# EAGLE design feather_stm32f1 (EAGLE 9.2.2)
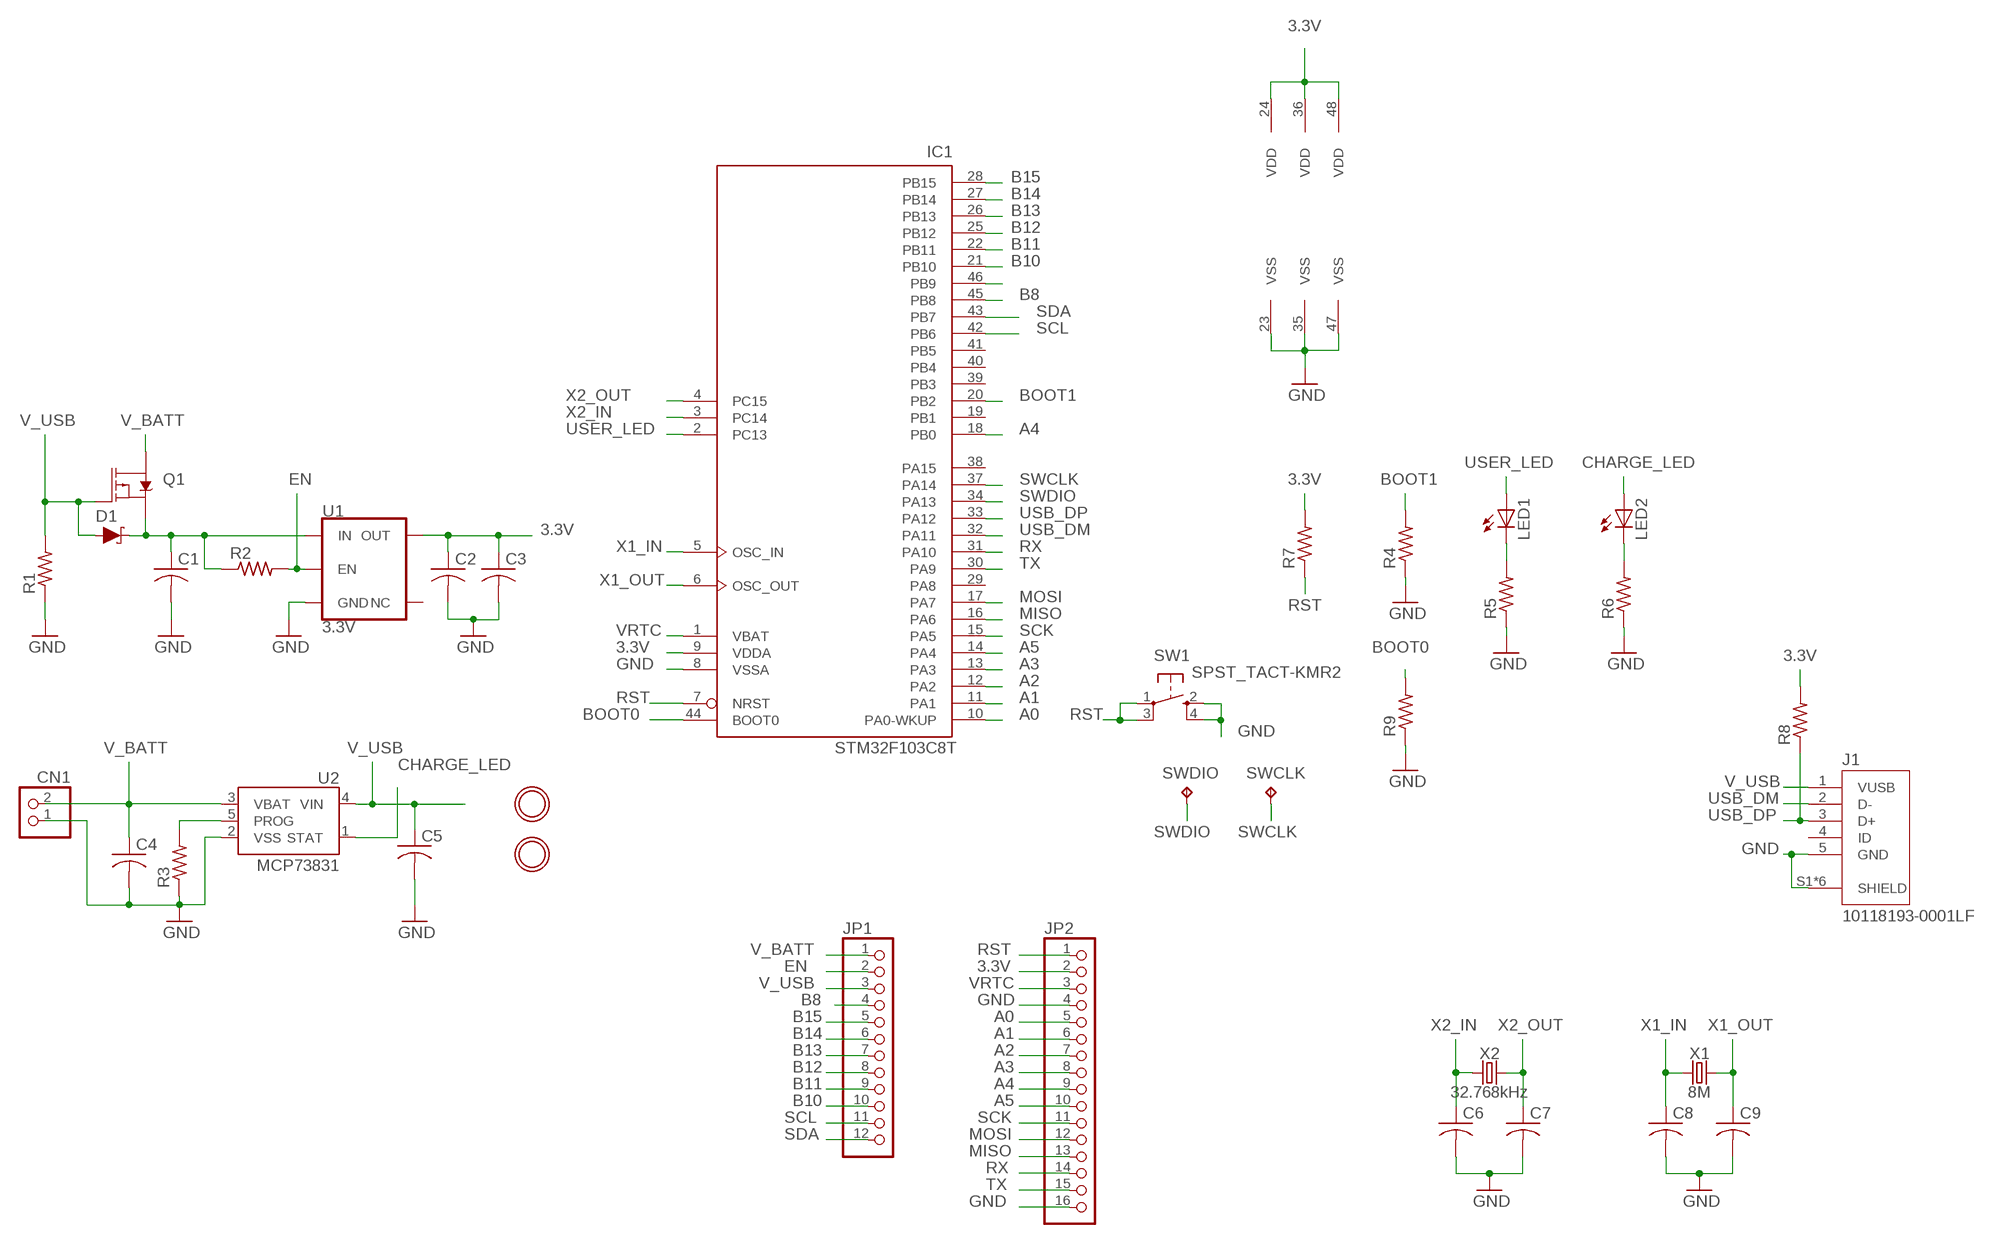
[diagram p0: schematic, sheet 1]

## Parts
C1  C-USC0805  [C0805]
C2  C-USC0805  [C0805]
C3  C-USC0805  [C0805]
C4  C-USC0805  [C0805]
C5  C-USC0805  [C0805]
C6  C-USC0603  [C0603]
C7  C-USC0603  [C0603]
C8  C-USC0603  [C0603]
C9  C-USC0603  [C0603]
CN1  JST_2PIN-SMT-RA  [JST-PH-2-SMT-RA]
D1  DIODE-SCHOTTKY-BAT20J  [SOD-323]
IC1  STM32F103C8T  [LQFP48]
J1  10118193-0001LF  [FCI_10118193-0001LF]
JP1  PINHD-1X12-CB  [1X12-CB]
JP2  PINHD16  [1X16-CB]
LED1  LEDCHIPLED_0603  [CHIPLED_0603]
LED2  LEDCHIPLED_0603  [CHIPLED_0603]
Q1  MOSFET_PCH-DMG2307L  [SOT23-3]
R1  R-US_R0603  [R0603]
R2  R-US_R0603  [R0603]
R3  R-US_R0603  [R0603]
R4  R-US_R0603  [R0603]
R5  R-US_R0603  [R0603]
R6  R-US_R0603  [R0603]
R7  R-US_R0603  [R0603]
R8  R-US_R0603  [R0603]
R9  R-US_R0603  [R0603]
SW1  SPST_TACT-KMR2  [KMR2]
SWCLK  TPTP20R  [TP20R]
SWDIO  TPTP20R  [TP20R]
U1  3.3V  V_REG_AP2112K-3.3V  [SOT23-5]
U2  MCP73831  [SOT23-5]
U$1  MOUNTINGHOLE2.5  [MOUNTINGHOLE_2.5_PLATED]
U$31  MOUNTINGHOLE2.5  [MOUNTINGHOLE_2.5_PLATED]
X1  8M  CRYSTALSMD-5X3.2-2PAD  [CRYSTAL-SMD-5X3.2-2PAD]
X2  32.768kHz  CRYSTAL-32.768KHZSMD-3.2X1.5  [CRYSTAL-SMD-3.2X1.5MM]

## Nets
3.3V: C2.1 C3.1 IC1.9(VDDA) IC1.24(VDD) IC1.36(VDD) IC1.48(VDD) JP2.2 R7.2 R8.2 U1.5(OUT)
A0: IC1.10(PA0-WKUP) JP2.5
A1: IC1.11(PA1) JP2.6
A2: IC1.12(PA2) JP2.7
A3: IC1.13(PA3) JP2.8
A4: IC1.18(PB0) JP2.9
A5: IC1.14(PA4) JP2.10
B8: IC1.45(PB8) JP1.4
B10: IC1.21(PB10) JP1.10
B11: IC1.22(PB11) JP1.9
B12: IC1.25(PB12) JP1.8
B13: IC1.26(PB13) JP1.7
B14: IC1.27(PB14) JP1.6
B15: IC1.28(PB15) JP1.5
BOOT0: IC1.44(BOOT0) R9.2
BOOT1: IC1.20(PB2) R4.2
CHARGE_LED: LED2.A U2.1(STAT)
EN: JP1.2 R2.2 U1.3(EN)
GND: C1.2 C2.2 C3.2 C4.2 C5.2 C6.2 C7.2 C8.2 C9.2 CN1.1 IC1.8(VSSA) IC1.23(VSS) IC1.35(VSS) IC1.47(VSS) J1.5(GND) J1.S1(SHIELD) J1.S2(SHIELD) J1.S3(SHIELD) J1.S4(SHIELD) J1.S5(SHIELD) J1.S6(SHIELD) JP2.4 JP2.16 R1.1 R3.1 R4.1 R5.1 R6.1 R9.1 SW1.2(S) SW1.4(S1) U1.2(GND) U2.2(VSS)
MISO: IC1.16(PA6) JP2.13
MOSI: IC1.17(PA7) JP2.12
N$1: C1.1 D1.C Q1.2(S) R2.1 U1.1(IN)
N$2: R3.2 U2.5(PROG)
N$4: LED1.C R5.2
N$5: LED2.C R6.2
N$30: IC1.46(PB9)
RST: IC1.7(NRST) JP2.1 R7.1 SW1.1(P) SW1.3(P1)
RX: IC1.31(PA10) JP2.14
SCK: IC1.15(PA5) JP2.11
SCL: IC1.42(PB6) JP1.11
SDA: IC1.43(PB7) JP1.12
SWCLK: IC1.37(PA14) SWCLK.TP
SWDIO: IC1.34(PA13) SWDIO.TP
TX: IC1.30(PA9) JP2.15
USB_DM: IC1.32(PA11) J1.2(D-)
USB_DP: IC1.33(PA12) J1.3(D+) R8.1
USER_LED: IC1.2(PC13) LED1.A
V_BATT: C4.1 CN1.2 JP1.1 Q1.3(D) U2.3(VBAT)
V_USB: C5.1 D1.A J1.1(VUSB) JP1.3 Q1.1(G) R1.2 U2.4(VIN)
VRTC: IC1.1(VBAT) JP2.3
X1_IN: C8.1 IC1.5(OSC_IN) X1.P$1
X1_OUT: C9.1 IC1.6(OSC_OUT) X1.P$2
X2_IN: C6.1 IC1.3(PC14) X2.P$1
X2_OUT: C7.1 IC1.4(PC15) X2.P$2
Unconnected: IC1.19(PB1) IC1.29(PA8) IC1.38(PA15) IC1.39(PB3) IC1.40(PB4) IC1.41(PB5) J1.4(ID) U1.4(NC)

## Library data of the parts
C1-C9 = rcl:C-US: CAPACITOR, American symbol; SPICEPREFIX: C
CN1 = adafruit:JST_2PIN: JST 2-Pin Connectors of various flavors SMT-RA (S2B-PH-SM4) 4UConnector #17311 SMT (B2B-PH-SM4) THM-RA (S2B-PH) THM (B2B-PH)
D1 = SparkFun-DiscreteSemi:DIODE-SCHOTTKY: Schottky diode A Schottky diode is a semiconductor diode which has a low forward voltage drop and a very fast switching action.; PROD_ID: DIO-11623; VALUE: 1A/23V/620mV
IC1 = micro-stm:STM32F103C*T: ARM 32-bit Cortex™-M3 CPU 72 MHz maximum frequency 16 to 128 Kbytes of Flash memory 6 to 20 kbytes of SRAM 37 GPIOs 2.0 to 3.6 V application supply
J1 = 10118193-0001LF:10118193-0001LF: Micro USB B Type Receptacle; DESCRIPTION: Single Port 5 Contact Shielded SMT MICRO USB B-Type Receptacle; DIGI-KEY_PART_NUMBER: 609-4616-1-ND; DIGI-KEY_PURCHASE_URL: https://www.digikey.tw/product-detail/en/amphenol-icc-fci/10118193-0001LF/609-4616-1-ND/2785380?utm_source=snapeda&utm_medium=aggregator&utm_campaign=symbol; MF: Amphenol ICC; MP: 10118193-0001LF; PACKAGE: None
JP1 = adafruit:PINHD-1X12: PIN HEADER
JP2 = explora26:PINHD16
LED1 LED2 = adafruit:LED: LED OSRAM: - CHIPLED LG R971, LG N971, LY N971, LG Q971, LY Q971, LO R971, LY R971 LH N974, LH R974 LS Q976, LO Q976, LY Q976 LO Q996 - Hyper CHIPLED LW Q18S LB Q993, LB Q99A, LB R99A - SideLED LS A670, LO A670, LY A670, LG A670, LP A670 LB A673, LV A673, LT A673, LW A673 LH A674 LY A675 LS A676, LA A676, LO A676, LY A676, LW A676 LS A679, LY A679, LG A679 - Hyper Micro SIDELED® LS Y876, LA Y876, LO Y876, LY Y876 LT Y87S - SmartLED LW L88C, LW L88S LB L89C, LB L89S, LG L890 LS L89K, LO L89K, LY L89K LS L896, LA L896, LO L896, LY L896 - TOPLED LS T670, LO T670, LY T670, LG T670, LP T670 LSG T670, LSP T670, LSY T670, LOP T670, LYG T670 LG T671, LOG T671, LSG T671 LB T673, LV T673, LT T673, LW T673 LH T674 LS T676, LA T676, LO T676, LY T676, LB T676, LH T676, LSB T676, LW T676 LB T67C, LV T67C, LT T67C, LS T67K, LO T67K, LY T67K, LW E67C LS E67B, LA E67B, LO E67B, LY E67B, LB E67C, LV E67C, LT E67C LW T67C LS T679, LY T679, LG T679 LS T770, LO T770, LY T770, LG T770, LP T770 LB T773, LV T773, LT T773, LW T773 LH T774 LS E675, LA E675, LY E675, LS T675 LS T776, LA T776, LO T776, LY T776, LB T776 LHGB T686 LT T68C, LB T68C - Hyper Mini TOPLED® LB M676 - Mini TOPLED Santana® LG M470 LS M47K, LO M47K, LY M47K Source: http://www.osram.convergy.de/
Q1 = SparkFun-DiscreteSemi:MOSFET_PCH: P-channel MOSFETs Voltage controlled devices that allow control of high current outputs. SparkFun Products: SparkFun ESP32 Thing <https://www.sparkfun.com/products/13907> SparkFun ESP8266 Thing <https://www.sparkfun.com/products/13231>; PROD_ID: TRANS-11308; VALUE: 2.5A/30V/105mΩ
R1-R9 = rcl:R-US_: RESISTOR, American symbol; SPICEPREFIX: R
SW1 = adafruit:SPST_TACT: SMT 6mm switch, EVQQ2 series http://www.ladyada.net/library/eagle
SWCLK SWDIO = testpad:TP: Test pad
U1 = SparkFun-IC-Power:V_REG_AP2112: AP2112 - 600mA CMOS LDO Regulator w/ Enable The AP2112 is CMOS process low dropout linear regulator with enable function, the regulator delivers a guaranteed 600mA (min.) continuous load current. Features Output Voltage Accuracy: ±1.5% Output Current: 600mA (Min.) Foldback Short Current Protection: 50mA Enable Function to Turn ON/OFF VOUT Low Dropout Voltage (3.3V): 250mV (Typ.) @IOUT=600mA Excellent Load Regulation: 0.2%/A (Typ.) Excellent Line Regulation: 0.02%/V (Typ.) Low Quiescent Current: 55μA (Typ.) Low Standby Current: 0.01μA (Typ.) Low Output Noise: 50μVRMS PSRR: 100Hz -65dB, 1kHz -65dB OTSD Protection Stable with 1.0μF Flexible Cap: Ceramic, Tantalum and Aluminum Electrolytic Operation Temperature Range: -40°C to 85°C ESD: MM 400V, HBM 4000V; PROD_ID: VREG-12457
U2 = SparkFun-IC-Power:MCP73831: MCP73831T Li-Ion, Li-Pol Controller Miniature single cell, fully integrated Li-Ion, Li-polymer charge management controller Datasheet <http://ww1.microchip.com/downloads/en/DeviceDoc/20001984g.pdf> SparkFun Products: SparkFun ESP32 Thing <https://www.sparkfun.com/products/13907> SparkFun 9DoF Razor IMU M0 <https://www.sparkfun.com/products/14001>; PROD_ID: IC-09995
U$1 U$31 = microbuilder:MOUNTINGHOLE: Mounting Hole For #2 screws (0.086"/2.18mm width, 0.094"/2.4mm hole) use 2.5mm; BOM: EXCLUDE
X1 = SparkFun-Clocks:CRYSTAL: Crystals (Generic) These are passive quartz crystals, which can be used as a clock source for a microcontroller. Crystal's are two-terminal devices. They require external "load" capacitors to generate an oscillating signal.
X2 = SparkFun-Clocks:CRYSTAL-32.768KHZ: 32.768kHz Crystal Frequency: 32.768kHz Frequency Stability: ±20ppm Load Capacitance: 12.5pF (PTH-2X6 & SMD-3.2X1.5), 6pF (SMD-2X6) SparkFun Products: SparkFun BigTime Watch Kit <https://www.sparkfun.com/products/11734> SparkFun nRF52832 Breakout <https://www.sparkfun.com/products/13990> SparkFun Real Time Clock Module <https://www.sparkfun.com/products/12708>; PROD_ID: XTAL-13062

## Board
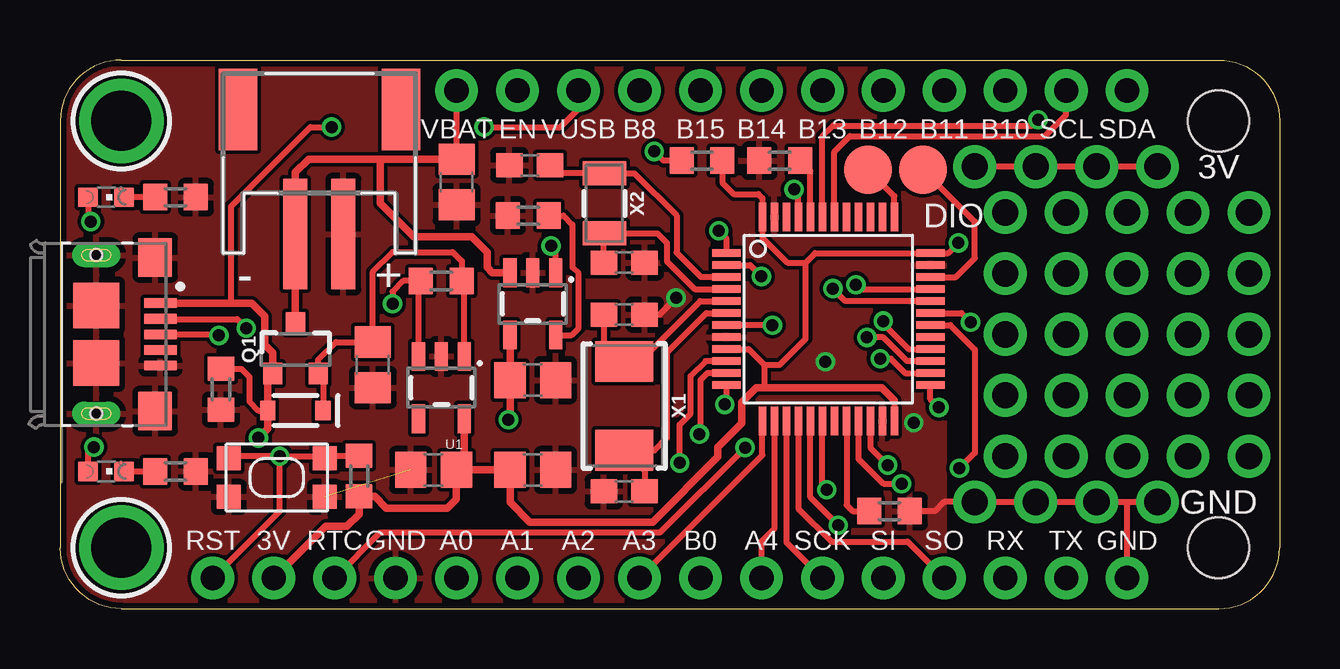
[diagram p1: board, top side]
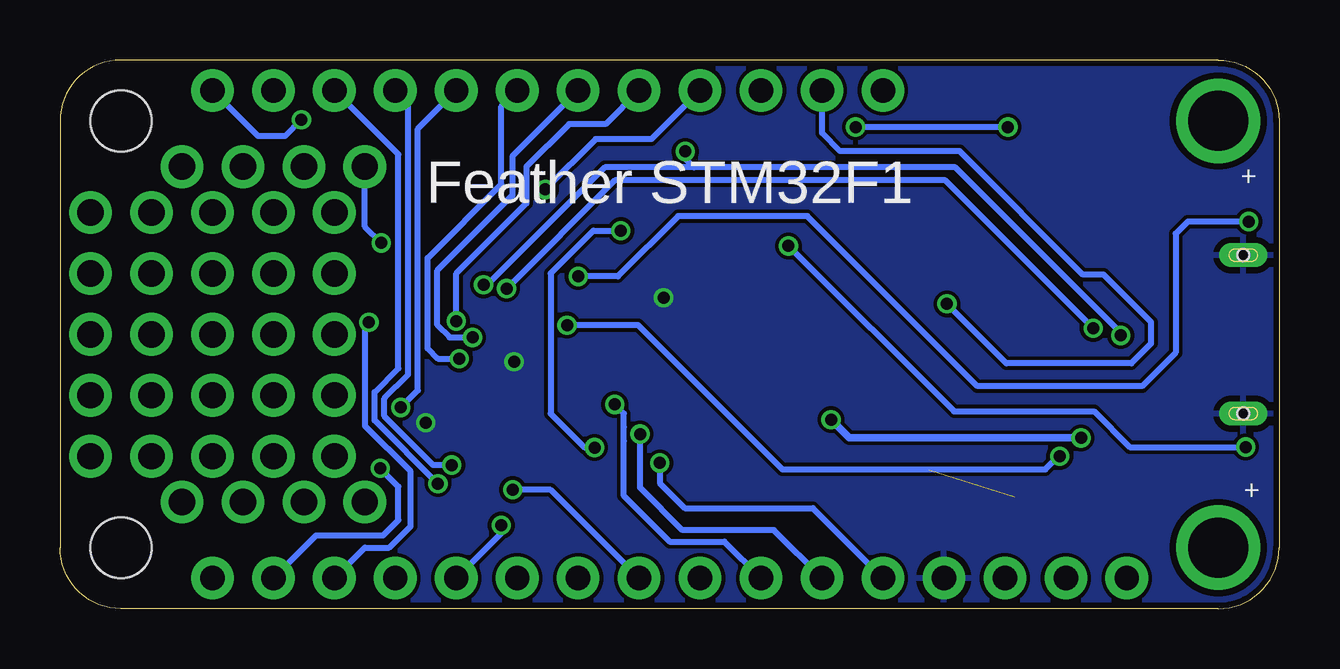
[diagram p2: board, bottom side, seen from below]

Size 50.8 x 22.86 mm. Coordinates in mm from the lower left corner, seen from the top.
Outline: 2.54,0 48.26,0 arc90 50.8,2.54 50.8,20.32 arc90 48.26,22.86 2.54,22.86 arc90 0,20.32 0,2.54 arc90 2.54,0
Copper layers (1*16): Top 0.035mm / dielectric 1.5mm / Bottom 0.035mm
Design rules "SeeedStudio_2layer_DRU_no_angle_20140221 *": minimum track width 6mil, minimum drill 12mil, track to track 6mil, track to pad 6mil, pad to pad 6mil, via to via 6mil, smd to smd 0mil, copper to edge 10mil, drill to drill 12mil, minimum pad ring 10mil, minimum via ring 6mil, stop-mask expansion 2mil, vias tented up to drill 100mil, thermal gap 10mil
Holes 2.54 mm at 48.26,20.32 48.26,2.54

### Footprints (pad centres in the part's own frame; a part is rotated, then mirrored left to right if it is on the bottom)
C0805 = smd 1.3 x 1.5: 1 -0.95,0; 2 0.95,0
C0603 = smd 1.1 x 1: 1 -0.85,0; 2 0.85,0
JST-PH-2-SMT-RA = smd 1 x 4.6: 1 1,-3.7; 2 -1,-3.7 | smd 1.6 x 3.4: NC1 -3.4,1.5; NC2 3.4,1.5
SOD-323 = smd 0.63 x 0.83: A 1.15,0; C -1.15,0
LQFP48 = smd 0.3 x 1.2: 1 -2.75,-4.25; 2 -2.25,-4.25; 3 -1.75,-4.25; 4 -1.25,-4.25; 5 -0.75,-4.25; 6 -0.25,-4.25; 7 0.25,-4.25; 8 0.75,-4.25; 9 1.25,-4.25; 10 1.75,-4.25; 11 2.25,-4.25; 12 2.75,-4.25; 25 2.75,4.25; 26 2.25,4.25; 27 1.75,4.25; 28 1.25,4.25; 29 0.75,4.25; 30 0.25,4.25; 31 -0.25,4.25; 32 -0.75,4.25; 33 -1.25,4.25; 34 -1.75,4.25; 35 -2.25,4.25; 36 -2.75,4.25 | smd 1.2 x 0.3: 13 4.25,-2.75; 14 4.25,-2.25; 15 4.25,-1.75; 16 4.25,-1.25; 17 4.25,-0.75; 18 4.25,-0.25; 19 4.25,0.25; 20 4.25,0.75; 21 4.25,1.25; 22 4.25,1.75; 23 4.25,2.25; 24 4.25,2.75; 37 -4.25,2.75; 38 -4.25,2.25; 39 -4.25,1.75; 40 -4.25,1.25; 41 -4.25,0.75; 42 -4.25,0.25; 43 -4.25,-0.25; 44 -4.25,-0.75; 45 -4.25,-1.25; 46 -4.25,-1.75; 47 -4.25,-2.25; 48 -4.25,-2.75
FCI_10118193-0001LF = smd 0.4 x 1.35: 1 -1.3,2.675; 2 -0.65,2.675; 3 0,2.675; 4 0.65,2.675; 5 1.3,2.675 | smd 1.6 x 1.4: S1 -3.2,2.45; S2 3.2,2.45 | smd 1.9 x 1.9: S3 1.2,0; S4 -1.2,0 | drill 0.5 pad 0.9 long: S5 -3.3,0; S6 3.3,0 | hole 0.5: -3.3,0; 3.3,0
1X12-CB = drill 1.016 pad 1.778: 1 -13.97,0; 2 -11.43,0; 3 -8.89,0; 4 -6.35,0; 5 -3.81,0; 6 -1.27,0; 7 1.27,0; 8 3.81,0; 9 6.35,0; 10 8.89,0; 11 11.43,0; 12 13.97,0
1X16-CB = drill 1.016 pad 1.778: 1 -19.05,0; 2 -16.51,0; 3 -13.97,0; 4 -11.43,0; 5 -8.89,0; 6 -6.35,0; 7 -3.81,0; 8 -1.27,0; 9 1.27,0; 10 3.81,0; 11 6.35,0; 12 8.89,0; 13 11.43,0; 14 13.97,0; 15 16.51,0; 16 19.05,0
CHIPLED_0603 = smd 0.8 x 0.8: A 0,-0.75; C 0,0.75
SOT23-3 = smd 0.8 x 0.9: 1 -0.95,-1; 2 0.95,-1; 3 0,1.1
R0603 = smd 1 x 1.1: 1 -0.85,0; 2 0.85,0
KMR2 = smd 1 x 1: 1 2,0.8; 2 2,-0.8; 3 -2,0.8; 4 -2,-0.8
TP20R = smd 2 x 2: TP 0,0
SOT23-5 = smd 0.55 x 1.2: 1 -0.95,-1.3; 2 0,-1.3; 3 0.95,-1.3; 4 0.95,1.3; 5 -0.95,1.3
MOUNTINGHOLE_2.5_PLATED = drill 2.5 pad 3.2: P$1 0,0
CRYSTAL-SMD-5X3.2-2PAD = smd 1.7 x 2.4: P$1 1.85,0; P$2 -1.85,0
CRYSTAL-SMD-3.2X1.5MM = smd 1 x 1.8: P$1 -1.25,0; P$2 1.25,0

### Placement (x,y rotation side)
C1  13.02,10.16 270 top
C2  15.55,5.78 180 top
C3  19.68,5.78 0 top
C4  16.51,17.78 270 top
C5  19.68,9.53 0 top
C6  19.56,18.48 180 top
C7  23.5,14.41 0 top
C8  23.5,12.26 0 top
C9  23.5,4.89 180 top
CN1  10.79,19.3 0 top
D1  9.79,8.26 180 top
IC1  32,12.06 270 top
J1  1.5,11.43 270 top
JP1  30.48,21.59 0 top
JP2  25.4,1.27 0 top
LED1  1.91,17.14 270 top
LED2  1.91,5.71 270 top
Q1  9.79,10.79 0 top
R1  6.69,9.14 90 top
R2  15.88,13.65 180 top
R3  19.49,16.37 0 top
R4  34.54,4.06 180 top
R5  4.8,17.14 180 top
R6  4.8,5.71 180 top
R7  12.45,5.52 270 top
R8  26.73,18.67 0 top
R9  29.97,18.67 0 top
SW1  9.02,5.46 0 top
SWCLK  33.66,18.29 0 top
SWDIO  35.94,18.29 0 top
U1  15.88,9.21 180 top
U2  19.68,12.7 180 top
U$1  2.54,20.32 0 top
U$31  2.54,2.54 0 top
X1  23.5,8.45 90 top
X2  22.67,16.89 270 top

### Tracks (layer width: path | path; a pad name or v marks a point on that pad's centre or on a via)
3.3V  (via drill 0.5, 1.1 pad 1.78)
  Top 0.254: v45.72,18.41 v43.18,18.41 v40.64,18.41 v38.1,18.41 | 34.75,8.68 IC1.24 | IC1.9 28.68,10.81 29.34,10.16 | 31.05,14.41 31.05,11.24 29.97,10.16 29.34,10.16 | 31.05,14.41 31.45,14.81 IC1.36 36.99,14.81 v37.42,15.24 | 31.05,14.41 30.29,14.41 29.25,15.45 IC1.48 29.25,17.1 29.08,17.27 28.07,17.27 27.58,17.76 R8.2 | 29.34,10.16 29.34,9.2
  Top 0.305: U1.5 16.82,6.1 C2.1 | 34.75,8.68 34.23,9.2 29.34,9.2 29,9.2 28.4,8.6 28.4,7.73 27.4,6.73 27.4,6.33 24.68,3.61 19.56,3.61 18.73,4.43 C3.1 C2.1 | JP2.2 10.54,2.92 11.05,3.43 11.94,3.43 12.45,3.94 R7.2 13.11,4.67 13.59,4.19 16.13,4.19 16.5,4.56 C2.1
  Bottom 0.254: v37.42,15.24 38.1,15.92 v38.1,18.41
A0  (via drill 0.5)
  Top 0.254: IC1.10 26.89,10.31 26.26,9.69 26.26,8.13 25.81,7.67 v25.81,6.07
  Bottom 0.254: v25.81,6.07 25.81,5.23 24.77,4.19 19.43,4.19 JP2.5
A1  (via drill 0.5)
  Top 0.254: IC1.11 26.96,9.81 26.67,9.53 26.67,7.31 v26.63,7.28
  Bottom 0.254: JP2.6 21.06,3.28 24.87,3.28 26.63,5.04 v26.63,7.28
A2  (via drill 0.5)
  Top 0.254: IC1.12 27.75,8.58 v27.69,8.51
  Bottom 0.254: JP2.7 23.11,2.79 25.4,2.79 27.3,4.7 27.3,6.99 27.31,6.99 27.31,7.56 27.3,7.57 27.3,8.13 v27.69,8.51
A3
  Top 0.254: JP2.8 29.25,6.39 IC1.13
A4  (via drill 0.5)
  Top 0.254: v31.94,4.95 31.75,5.13 IC1.18
  Bottom 0.254: JP2.9 30.35,4.95 v31.94,4.95
A5
  Top 0.254: IC1.14 29.75,3.34 29.21,2.79 JP2.10
B8  (via drill 0.5)
  Top 0.254: IC1.45 30.75,17.29 v30.57,17.47
  Bottom 0.254: v30.57,17.47 28.48,19.56 26.16,19.56 JP1.4
B10  (via drill 0.5)
  Top 0.254: IC1.21 33.25,6.24 34.29,5.21 v35.05,5.21
  Bottom 0.254: v35.05,5.21 37.69,7.85 37.69,9.02 36.7,10.01 36.7,18.92 JP1.10
B11  (via drill 0.5)
  Top 0.254: IC1.22 33.75,6.71 v34.48,5.99
  Bottom 0.254: v34.48,5.99 35.26,5.99 37.29,8.02 37.29,8.76 36.3,9.75 36.3,13.84 36.3,21.06 JP1.9
B12  (via drill 0.5)
  Top 0.254: v36.6,8.38 36.25,8.73 IC1.25
  Bottom 0.254: v36.6,8.38 35.89,9.1 35.89,19.99 JP1.8
B13  (via drill 0.5)
  Top 0.254: v34.16,10.41 34.6,10.41 35.2,9.81 IC1.26
  Bottom 0.254: v34.16,10.41 35.05,10.41 35.48,10.85 35.48,14.61 32.41,17.68 32.41,20.93 JP1.7
B14  (via drill 0.5)
  Top 0.254: IC1.27 35.28,10.31 34.29,11.3 v33.61,11.3
  Bottom 0.254: v33.61,11.3 34.57,11.3 35.08,11.81 35.08,14.1 31.95,17.22 31.95,18.85 JP1.6
B15  (via drill 0.5)
  Top 0.254: IC1.28 35.35,10.81 34.29,11.88 v34.29,11.98
  Bottom 0.254: v34.29,11.98 34.29,13.97 31.37,16.89 31.37,18.41 29.59,20.19 28.07,20.19 JP1.5
BOOT0
  Top 0.254: IC1.44 31.25,18.24 R9.2
BOOT1
  Top 0.254: IC1.20 32.77,7.8 32.77,4.32 33.02,4.06 R4.2
CHARGE_LED  (via drill 0.5)
  Top 0.254: LED2.A 1.16,6.49 v1.4,6.73 | U2.1 20.64,14.93 v20.45,15.11
  Bottom 0.254: v1.4,6.73 6.22,6.73 7.71,8.21 13.55,8.21 v20.45,15.11
EN  (via drill 0.5)
  Top 0.254: U1.3 14.93,13.55 R2.2 14.29,13.65 13.84,13.21 v13.84,12.7
  Bottom 0.254: JP1.2 19.05,19.81 18.3,19.06 13.32,19.06 8.18,13.92 7.32,13.92 5.33,11.94 5.33,11.05 6.16,10.22 11.37,10.22 v13.84,12.7
GND  (via drill 0.5, 1.1 pad 1.78)  (1 unrouted)
  Top 0.254: v25.65,12.95 24.96,12.26 C8.2 | R4.1 36.45,4.06 36.83,4.45 v38.1,4.45 v40.64,4.45 v43.18,4.45 44.45,4.45 | 44.45,4.45 v45.72,4.45 | JP2.16 44.45,4.45
  other vias: 35.56,7.75 31.88,10.29
  pour Top: 0,0 36.83,0 36.83,22.86 0,22.86
  pour Bottom: 0,22.86 0,0 36.83,0 36.83,22.86
MISO
  Top 0.254: IC1.16 30.75,4.17 32.13,2.79 35.31,2.79 JP2.13
MOSI  (via drill 0.5)
  Top 0.254: v32.41,3.48 31.25,4.63 IC1.17
  Bottom 0.254: JP2.12 32.41,3.15 v32.41,3.48
N$1
  Top 0.254: D1.C 10.95,9.6 Q1.2 10.74,10.36 11.49,11.11 C1.1 13.02,14.03 13.84,14.86 16.34,14.86 16.73,14.48 R2.1 16.82,13.55 U1.1
N$2
  Top 0.254: U2.5 21.31,11.4 21.59,11.68 21.59,13.97 21.34,14.22 21.34,16 20.96,16.37 R3.2
N$3  (via drill 1.1 pad 1.78)
  other vias: 49.53,16.51
N$4
  Top 0.254: R5.2 LED1.C
N$5
  Top 0.254: LED2.C R6.2
N$6  (via drill 1.1 pad 1.78)
  other vias: 49.53,13.97
N$7  (via drill 1.1 pad 1.78)
  other vias: 49.53,11.43
N$8  (via drill 1.1 pad 1.78)
  other vias: 49.53,8.89
N$9  (via drill 1.1 pad 1.78)
  other vias: 49.53,6.35
N$10  (via drill 1.1 pad 1.78)
  other vias: 46.99,16.51
N$11  (via drill 1.1 pad 1.78)
  other vias: 46.99,13.97
N$12  (via drill 1.1 pad 1.78)
  other vias: 46.99,11.43
N$13  (via drill 1.1 pad 1.78)
  other vias: 46.99,8.89
N$14  (via drill 1.1 pad 1.78)
  other vias: 46.99,6.35
N$15  (via drill 1.1 pad 1.78)
  other vias: 44.45,16.51
N$16  (via drill 1.1 pad 1.78)
  other vias: 44.45,13.97
N$17  (via drill 1.1 pad 1.78)
  other vias: 44.45,11.43
N$18  (via drill 1.1 pad 1.78)
  other vias: 44.45,8.89
N$19  (via drill 1.1 pad 1.78)
  other vias: 44.45,6.35
N$20  (via drill 1.1 pad 1.78)
  other vias: 41.91,16.51
N$21  (via drill 1.1 pad 1.78)
  other vias: 41.91,13.97
N$22  (via drill 1.1 pad 1.78)
  other vias: 41.91,11.43
N$23  (via drill 1.1 pad 1.78)
  other vias: 41.91,8.89
N$24  (via drill 1.1 pad 1.78)
  other vias: 41.91,6.35
N$25  (via drill 1.1 pad 1.78)
  other vias: 39.37,16.51
N$26  (via drill 1.1 pad 1.78)
  other vias: 39.37,13.97
N$27  (via drill 1.1 pad 1.78)
  other vias: 39.37,11.43
N$28  (via drill 1.1 pad 1.78)
  other vias: 39.37,8.89
N$29  (via drill 1.1 pad 1.78)
  other vias: 39.37,6.35
RST  (via drill 0.5)
  Top 0.254: v29.67,11.81 IC1.7 | R7.1 11.13,6.38 SW1.1 10.93,6.35 v9.14,6.35 | v9.14,6.35 7.11,6.35 SW1.3 | JP2.1 9.14,4.06 v9.14,6.35
  Bottom 0.254: v29.67,11.81 26.71,11.81 20.7,5.8 9.74,5.8 9.2,6.35 v9.14,6.35
RX  (via drill 0.5)
  Top 0.254: IC1.31 37.54,12.31 v37.93,11.93
  Bottom 0.254: JP2.14 38.1,2.54 37.08,2.54 36.2,3.43 36.2,5.71 38.1,7.62 38.1,11.76 v37.93,11.93
SCK
  Top 0.254: IC1.15 30.25,2.77 JP2.11
SCL
  Top 0.254: JP1.11 41.91,20.57 41.02,19.68 32.89,19.68 32.25,19.05 IC1.42
SDA  (via drill 0.5)
  Top 0.254: v40.74,20.37 40.5,20.13 32.19,20.13 31.75,19.69 IC1.43
  Bottom 0.254: v40.74,20.37 41.42,19.68 42.55,19.68 JP1.12
SWCLK
  Top 0.254: IC1.37 34.75,17.19 SWCLK.TP
SWDIO
  Top 0.254: IC1.34 37.31,13.81 38.1,14.61 38.1,16.13 SWDIO.TP
TX  (via drill 0.5)
  Top 0.254: v37.46,5.85 38.1,6.49 38.1,10.79 37.08,11.81 IC1.30
  Bottom 0.254: JP2.15 40.13,3.05 37.34,3.05 36.7,3.68 36.7,5.08 37.46,5.84 v37.46,5.85
USB_DM  (via drill 0.5)
  Top 0.254: v32.19,13.34 32.71,12.81 IC1.32 | J1.2 4.19,12.06 7.37,12.06 v7.75,11.68
  Bottom 0.254: v7.75,11.68 13.91,17.84 27.68,17.84 v32.19,13.34
USB_DP  (via drill 0.5)
  Top 0.254: J1.3 6.56,11.43 v6.6,11.38 | v33.15,13.5 33.33,13.31 IC1.33 | R8.1 25.13,18.67 v24.75,19.05
  Bottom 0.254: v33.15,13.5 32.99,13.5 28.1,18.39 24.38,18.39 | v6.6,11.38 6.6,11.51 13.49,18.39 24.38,18.39 | v24.75,19.05 24.75,18.75 24.38,18.39
USER_LED  (via drill 0.5)
  Top 0.254: LED1.A 1.16,16.24 v1.27,16.13 | IC1.2 28.74,14.31 v29.21,13.84
  Bottom 0.254: v1.27,16.13 3.81,16.13 4.32,15.62 4.32,10.67 5.71,9.27 12.57,9.27 19.66,16.36 25.04,16.36 27.56,13.84 v29.21,13.84
V_BATT
  Top 0.254: C4.1 JP1.1
  Top 0.305: Q1.3 CN1.2 9.79,18.18 10.35,18.73 13.34,18.73 | 13.34,18.73 C4.1 | U2.3 18,14 17.78,14.22 17.78,14.86 17.14,15.49 14.73,15.49 13.34,16.89 13.34,18.73
V_USB  (via drill 0.5)
  Top 0.254: v18.67,7.87 18.73,7.94 | 7.11,12.73 7.11,16.76 10.41,20.07 v11.3,20.07 | v17.65,20.07 20.83,20.07 21.59,20.83 JP1.3 | R1.2 7.53,9.99 7.87,9.65 7.87,8.64 8.26,8.26 D1.A
  Top 0.305: U2.4 C5.1 18.73,7.94 | J1.1 7.11,12.73 7.97,12.73 8.51,12.19 8.51,11 8.85,10.67 Q1.1 8.64,9.6 D1.A 8.64,7.5 v8.26,7.11
  Bottom 0.254: v11.3,20.07 v17.65,20.07
  Bottom 0.305: v18.67,7.87 17.91,7.11 v8.26,7.11
VRTC  (via drill 0.5)
  Top 0.254: v27.43,15.75 27.75,15.43 IC1.1 | JP2.3 13.34,3.17 24.99,3.17 v28.53,6.71
  Bottom 0.254: v27.43,15.75 28.57,15.75 30.35,13.97 30.35,8.13 28.93,6.71 v28.53,6.71
X1_IN
  Top 0.254: IC1.5 26.66,12.81 24.14,10.3 X1.P$1 22.64,11.15 C8.1
X1_OUT
  Top 0.254: IC1.6 26.92,12.31 25.27,10.67 25.27,7.11 24.76,6.6 X1.P$2 24.34,5.75 C9.1
X2_IN
  Top 0.254: IC1.3 26.7,13.81 25.68,14.83 25.68,16.38 23.92,18.14 X2.P$1 20.75,18.14 C6.1
X2_OUT
  Top 0.254: IC1.4 26.44,13.31 25.27,14.48 25.27,15.24 24.87,15.64 X2.P$2 22.64,15.62 C7.1

### Text on the board
tPlace: VBAT | EN | VUSB | B8 | B15 | B14 | B13 | B12 | B11 | B10 | SCL | SDA | 3V | GND | RST | 3V | RTC | GND | A0 | A1 | A2 | A3 | B0 | A4 | SCK | SI | SO | RX | TX | GND
bPlace: + | Feather STM32F1 | +
tNames: DIO